# EAGLE schematic TK-BB-MD-06 (EAGLE 9.5.2)
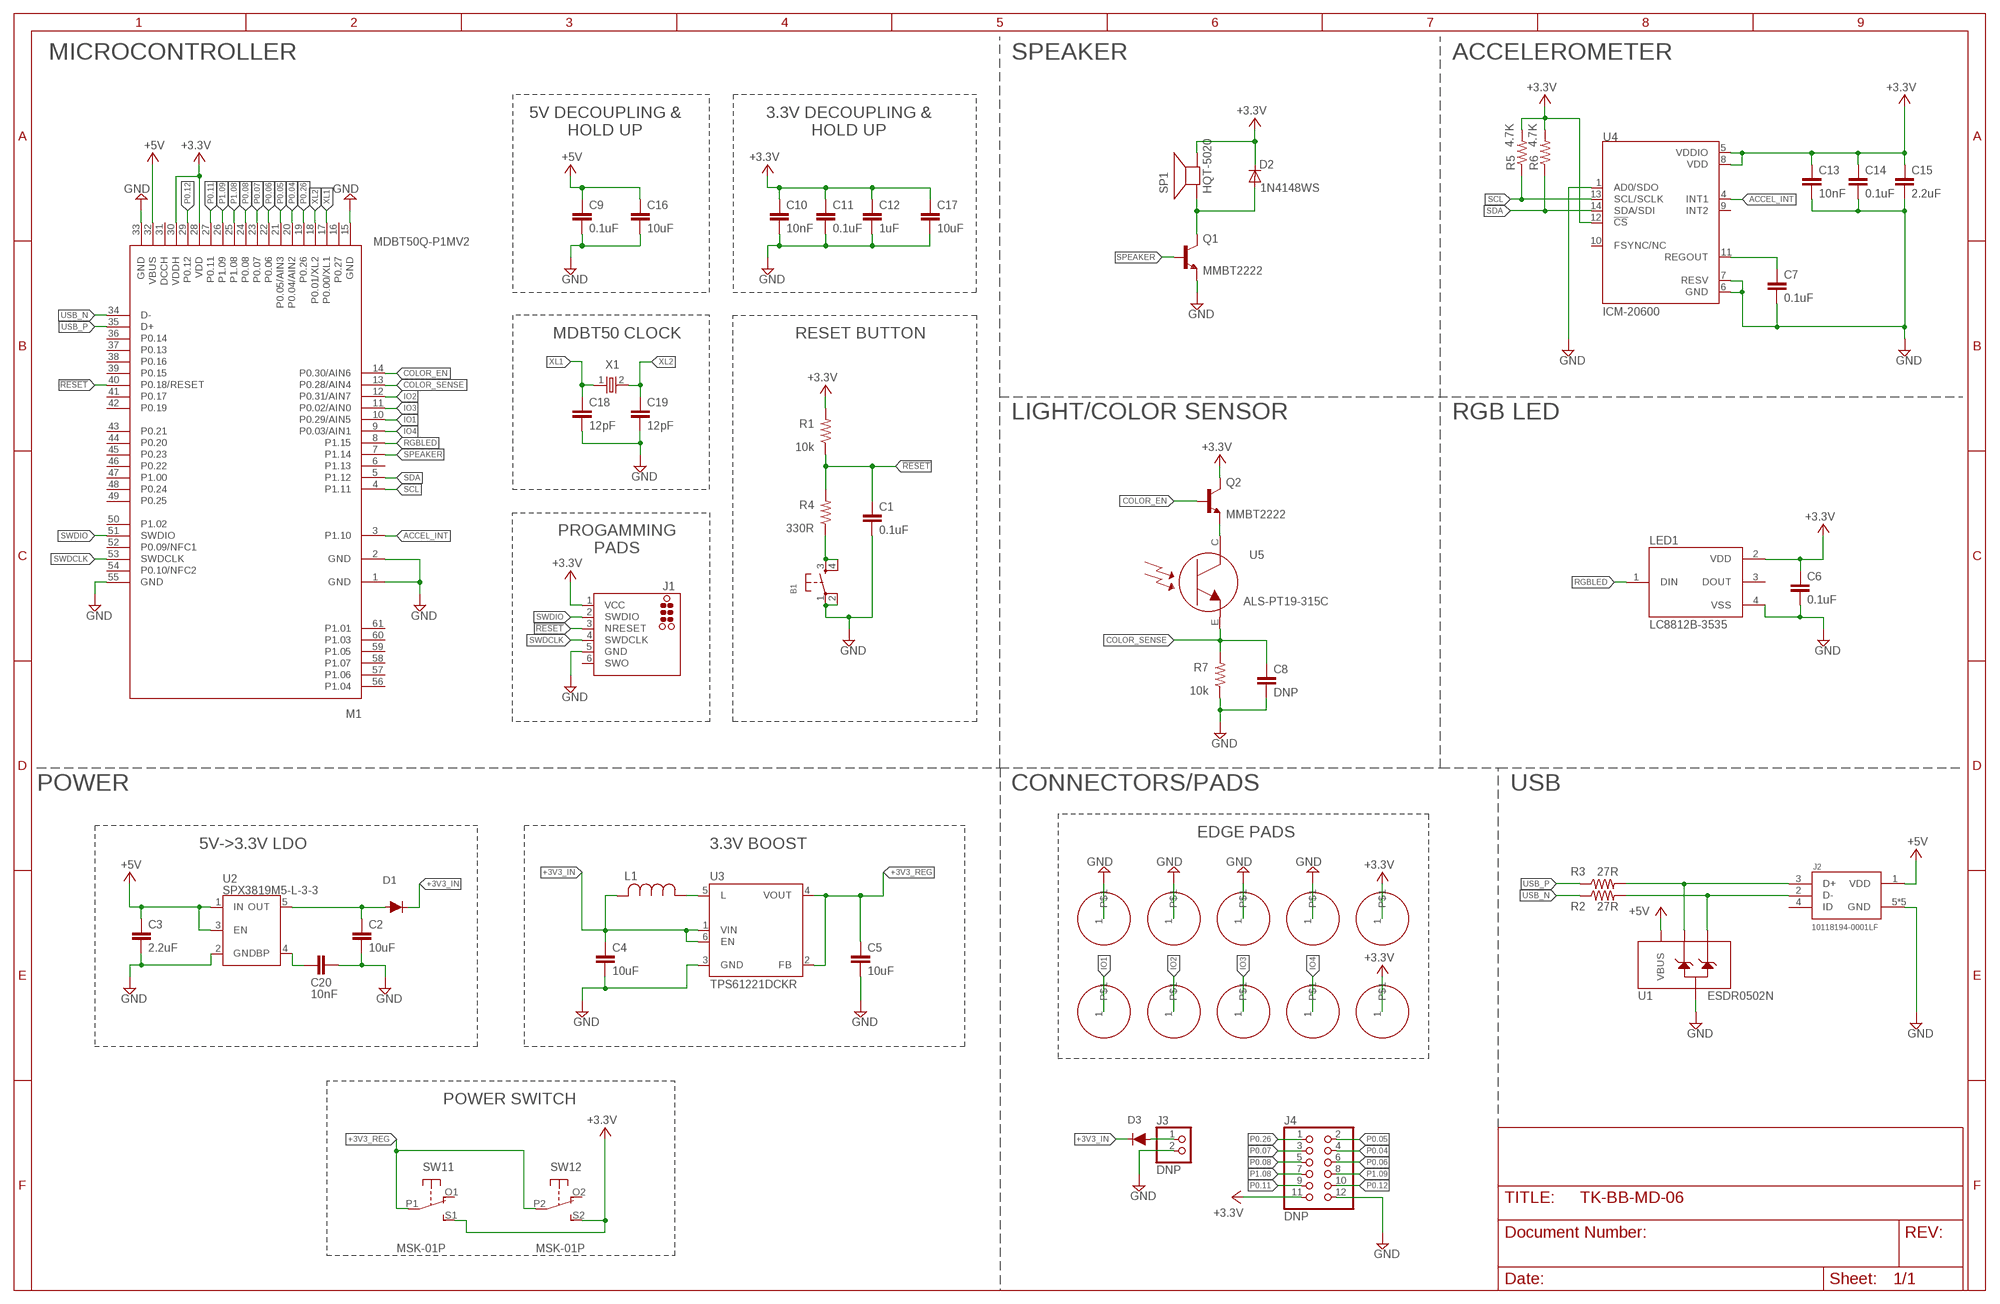
[diagram p0: schematic, sheet 1]

## Parts
B1  KFC-A04-02(H3.8)  BUTTON_SMT_3.8MMH_KFC-A04-02  [KFC-AO4-02]
C1  0.1uF  C_0.1UF_10V_0402  [0402]
C2  10uF  C_10UF_10V_0402  [0402]
C3  2.2uF  C_2.2UF_10V_0402  [0402]
C4  10uF  C_10UF_10V_0402  [0402]
C5  10uF  C_10UF_10V_0402  [0402]
C6  0.1uF  C_0.1UF_10V_0402  [0402]
C7  0.1uF  C_0.1UF_10V_0402  [0402]
C8  DNP  C_DNP_0402  [0402]
C9  0.1uF  C_0.1UF_10V_0402  [0402]
C10  10nF  C_10NF_10V_0402  [0402]
C11  0.1uF  C_0.1UF_10V_0402  [0402]
C12  1uF  C_1UF_10V_0402  [0402]
C13  10nF  C_10NF_10V_0402  [0402]
C14  0.1uF  C_0.1UF_10V_0402  [0402]
C15  2.2uF  C_2.2UF_10V_0402  [0402]
C16  10uF  C_10UF_10V_0402  [0402]
C17  10uF  C_10UF_10V_0402  [0402]
C18  12pF  C_12PF_50V_0402  [0402]
C19  12pF  C_12PF_50V_0402  [0402]
C20  10nF  C_10NF_10V_0402  [0402]
D1  NSR0320MW2T1G  DIODE_SCHOTTKY_NSR0320MW2T1G  [SOD323]
D2  1N4148WS  DIODE_1N148WSSOD-323  [SOD-323]
D3  NSR0320MW2T1G  DIODE_SCHOTTKY_NSR0320MW2T1G  [SOD323]
J1  DNP  TC2030-MCP-NL  [TC2030-MCP-NL]
J2  10118194-0001LF  [10118194-0001LF]
J3  DNP  PINHD-1X2  [1X02]
J4  DNP  PINHD-2X6  [2X06]
L1  4.7uH  SRN30104R7M_SRN3010-4R7M  [SRN30104R7M_IND_BOURNS_SRN3010]
LED1  LC8812B-3535  SK6812MINI_LC8812B-3535  [LC8812B-3535]
M1  MDBT50Q-P1MV2  [MDBT50]
P1  BB_CHICKLET_PADS_ROUND  [BB_CHICKLET_PAD]
P2  BB_CHICKLET_PADS_ROUND  [BB_CHICKLET_PAD]
P3  BB_CHICKLET_PADS_ROUND  [BB_CHICKLET_PAD]
P4  BB_CHICKLET_PADS_ROUND  [BB_CHICKLET_PAD]
P5  BB_CHICKLET_PADS_ROUND  [BB_CHICKLET_PAD]
P6  BB_CHICKLET_PADS_ROUND  [BB_CHICKLET_PAD]
P7  BB_CHICKLET_PADS_ROUND  [BB_CHICKLET_PAD]
P8  BB_CHICKLET_PADS_ROUND  [BB_CHICKLET_PAD]
P9  BB_CHICKLET_PADS_ROUND  [BB_CHICKLET_PAD]
P10  BB_CHICKLET_PADS_ROUND  [BB_CHICKLET_PAD]
Q1  MMBT2222  TRANSISTOR_NPN_MMBT2222_WIDE  [SOT23-WIDE]
Q2  MMBT2222  TRANSISTOR_NPN_MMBT2222_WIDE  [SOT23-WIDE]
R1  10k  R_10K_0.0625W_0402  [0402]
R2  27R  R_27R_0.0625W_0402  [0402]
R3  27R  R_27R_0.0625W_0402  [0402]
R4  330R  R_330R_0.0625W_0402  [0402]
R5  4.7K  R_4.7K_0.0625W_0402  [0402]
R6  4.7K  R_4.7K_0.0625W_0402  [0402]
R7  10k  R_10K_0.1W_0402  [0402]
SP1  HQT-5020  SPEAKER_HQT-5020  [HQT-5020]
SW1  MSK-01P  DPDT_MSK-01P  [MSK-01P]
U1  ESDR0502N  [6-UFDFN]
U2  SPX3819M5-L-3-3  SPX3819_3.3V  [SOT23-5]
U3  TPS61221DCKR  TPS61221  [SC70-6]
U4  ICM-20600  [ICM-20600]
U5  ALS-PT19-315C  [ALS-PT19-315C]
X1  32kHz 9pF  XTAL_32KHZ_9PF  [XTAL_3215_N]

## Nets
!RESET: C1.1 J1.3(NRESET) M1.40(P0.18/RESET) R1.1 R4.2
+3.3V: C6.1 C10.1 C11.1 C12.1 C13.1 C14.1 C15.1 C17.1 D2.C J1.1(VCC) J4.11 LED1.2(VDD) M1.28(VDD) M1.30(VDDH) P9.1 P10.1 Q2.3(C) R1.2 R5.2 R6.2 SP1.- SW1.S1(1:S) SW1.S2(2:S) U4.5(VDDIO) U4.8(VDD) U4.12(!CS)
+3V3_IN: C4.1 D1.1(C) D3.1(C) L1.2 U3.1(VIN) U3.6(EN)
+3V3_IN_HDR: D3.2(A) J3.1
+3V3_REG: C5.1 SW1.P1(1:P) SW1.P2(2:P) U3.2(FB) U3.4(VOUT)
+5V: C3.1 C9.1 C16.1 J2.1(VDD) M1.32(VBUS) U1.P$6(VBUS) U2.1(IN) U2.3(EN)
ACCEL_INT: M1.3(P1.10) U4.4(INT1)
ACCEL_REGOUT: C7.1 U4.11(REGOUT)
ALS_C: Q2.2(E) U5.C
BOOST_L: L1.1 U3.5(L)
COLOR_EN: M1.14(P0.30/AIN6) Q2.1(B)
COLOR_SENSE: C8.1 M1.13(P0.28/AIN4) R7.2 U5.E
GND: B1.1(P) B1.2(P1) C1.2 C2.2 C3.2 C4.2 C5.2 C6.2 C7.2 C8.2 C9.2 C10.2 C11.2 C12.2 C13.2 C14.2 C15.2 C16.2 C17.2 C18.2 C19.2 C20.2 J1.5(GND) J2.5(GND) J2.P$6(GND) J2.P$7(GND) J2.P$8(GND) J2.P$9(GND) J3.2 J4.12 LED1.4(VSS) M1.1(GND) M1.2(GND) M1.15(GND) M1.33(GND) M1.55(GND) P1.1 P2.1 P3.1 P8.1 Q1.2(E) R7.1 U1.P$1(GND) U2.2(GND) U3.3(GND) U4.1(AD0/SDO) U4.6(GND) U4.7(RESV)
IO1: M1.10(P0.29/AIN5) P6.1
IO2: M1.12(P0.31/AIN7) P4.1
IO3: M1.11(P0.02/AIN0) P7.1
IO4: M1.9(P0.03/AIN1) P5.1
LDO_BP: C20.1 U2.4(BP)
LDO_OUT: C2.1 D1.2(A) U2.5(OUT)
N$2: B1.3(S) B1.4(S1) R4.1
P0.04: J4.4 M1.20(P0.04/AIN2)
P0.05: J4.2 M1.21(P0.05/AIN3)
P0.06: J4.6 M1.22(P0.06)
P0.07: J4.3 M1.23(P0.07)
P0.08: J4.5 M1.24(P0.08)
P0.11: J4.9 M1.27(P0.11)
P0.12: J4.10 M1.29(P0.12)
P0.26: J4.1 M1.19(P0.26)
P1.08: J4.7 M1.25(P1.08)
P1.09: J4.8 M1.26(P1.09)
Q1_C: D2.A Q1.3(C) SP1.+
RGBLED: LED1.1(DIN) M1.8(P1.15)
SCL: M1.4(P1.11) R5.1 U4.13(SCL/SCLK)
SDA: M1.5(P1.12) R6.1 U4.14(SDA/SDI)
SPEAKER: M1.7(P1.14) Q1.1(B)
SWDCLK: J1.4(SWDCLK) M1.53(SWDCLK)
SWDIO: J1.2(SWDIO) M1.51(SWDIO)
USB_D+: J2.3(D+) R3.2 U1.P$2(D+) U1.P$5(D+)
USB_D-: J2.2(D-) R2.2 U1.P$3(D-) U1.P$4(D-)
USB_N: M1.34(D-) R2.1
USB_P: M1.35(D+) R3.1
XL1: C18.1 M1.17(P0.00/XL1) X1.1
XL2: C19.1 M1.18(P0.01/XL2) X1.2
Unconnected: J1.6(SWO) J2.4(ID) LED1.3(DOUT) M1.6(P1.13) M1.16(P0.27) M1.31(DCCH) M1.36(P0.14) M1.37(P0.13) M1.38(P0.16) M1.39(P0.15) M1.41(P0.17) M1.42(P0.19) M1.43(P0.21) M1.44(P0.20) M1.45(P0.23) M1.46(P0.22) M1.47(P1.00) M1.48(P0.24) M1.49(P0.25) M1.50(P1.02) M1.52(P0.09/NFC1) M1.54(P0.10/NFC2) M1.56(P1.04) M1.57(P1.06) M1.58(P1.07) M1.59(P1.05) M1.60(P1.03) M1.61(P1.01) SW1.O1(1:O) SW1.O2(2:O) U4.9(INT2) U4.10(FSYNC/NC)

## Notes on the sheet
- MICROCONTROLLER | SPEAKER | ACCELEROMETER
- 5V DECOUPLING &
  HOLD UP
- 3.3V DECOUPLING &
  HOLD UP
- MDBT50 CLOCK | RESET BUTTON
- LIGHT/COLOR SENSOR | RGB LED
- PROGAMMING
  PADS
- POWER | CONNECTORS/PADS | USB
- EDGE PADS
- 5V->3.3V LDO | 3.3V BOOST
- POWER SWITCH

## Library data of the parts
B1 = teknikio-button:BUTTON_SMT; DESCRIPTION: SWITCH TACT 4.5 X 4.5, 3.8 MM H; MANUFACTURER: Yeuqing City Ouke Electronics; MANUFACTURER_PART_NUMBER: KFC-A04-02(H3.8); SUPPLIER: Yeuqing City Ouke Electronics; SUPPLIER_PART_NUMBER: KFC-A04-02(H3.8)
C1 C6 C7 C9 C11 C14 = teknikio-passives:C: Standard SMD chip capacitors; DESCRIPTION: CAP CER 0.1UF 10V X7R 0402; MANUFACTURER: Yageo; MANUFACTURER_PART_NUMBER: CC0402KRX7R6BB104; SUPPLIER: Digi-Key; SUPPLIER_PART_NUMBER: 311-1345-1-ND
C2 C4 C5 C16 C17 = teknikio-passives:C: Standard SMD chip capacitors; DESCRIPTION: CAP CER 10UF 10V X5R 0402; MANUFACTURER: Samsung; MANUFACTURER_PART_NUMBER: CL05A106MP8NUB8; SUPPLIER: Digi-Key; SUPPLIER_PART_NUMBER: 1276-6830-1-ND
C3 C15 = teknikio-passives:C: Standard SMD chip capacitors; DESCRIPTION: CAP CER 2.2UF 10V X5R 0402; MANUFACTURER: Taiyo Yuden; MANUFACTURER_PART_NUMBER: LMK105BJ225MV-F; SUPPLIER: Digi-Key; SUPPLIER_PART_NUMBER: 587-3153-1-ND
C8 = teknikio-passives:C: Standard SMD chip capacitors; DESCRIPTION: 0402 CAP; MANUFACTURER: N/A; MANUFACTURER_PART_NUMBER: N/A; SUPPLIER: N/A; SUPPLIER_PART_NUMBER: N/A
C10 C13 C20 = teknikio-passives:C: Standard SMD chip capacitors; DESCRIPTION: CAP CER 10000PF 10V X7R 0402; MANUFACTURER: Yageo; MANUFACTURER_PART_NUMBER: C0402C103K8RACTU; SUPPLIER: Digi-Key; SUPPLIER_PART_NUMBER: 399-7759-1-ND
C12 = teknikio-passives:C: Standard SMD chip capacitors; DESCRIPTION: CAP CER 1UF 10V X5R 0402; MANUFACTURER: Yageo; MANUFACTURER_PART_NUMBER: CC0402KRX5R6BB105; SUPPLIER: Digi-Key; SUPPLIER_PART_NUMBER: 311-1439-1-ND
C18 C19 = teknikio-passives:C: Standard SMD chip capacitors; DESCRIPTION: CAP CER 12PF 50V C0G 0402; MANUFACTURER: TDK Corporation; MANUFACTURER_PART_NUMBER: CGA2B2C0G1H120J050BA; SUPPLIER: Digi-Key; SUPPLIER_PART_NUMBER: 445-5585-1-ND
D1 D3 = teknikio-passives:DIODE_SCHOTTKY; DESCRIPTION: DIODE SCHOTTKY 20V 1A SOD323; MANUFACTURER: ON Semiconductor; MANUFACTURER_PART_NUMBER: NSR0320MW2T1G; SUPPLIER: Digi-Key; SUPPLIER_PART_NUMBER: NSR0320MW2T1GOSCT-ND
D2 = teknikio-passives:DIODE: Diode SMA Model Volts Amps Type Vf Ir Digikey # Notes SSA34-E3 40V 3A Schottky 480mV @ 3A 200uA @ 40V SSA34-E3/61TGITR-ND CDBA120-G 20V 1A Schottky 500mV @ 1A 500uA @ 20V 641-1014-6-ND REEL MBRA210 10V 2A Schottky 350mV @ 2A 700uA @ 10V MBRA210LT3 SOD-123 Model Volts Amps Type Vf Ir Order # Notes BAT54T1G 30V 200mA Schottky 800mV @ 200mA 2uA @ 25V BAT54T1GOSTR-ND B0530W 30V 500mA Schottky 430mV @ 500mA 130uA @ 30V B0530W-FDICT-ND REEL MBR120 20V 1A Schottky 340mV @ 1A MBR120VLSFT1GOSCT-ND SOD-323 Model Volts Amps Type Vf Ir Order # Notes PMEG2005EJ 20V 500mA Schottky 355mV @ 500mA 568-4110-1-ND ZLLS410 10V 570mA Schottky 380mV @ 570mA ZLLS410CT-ND 1N4148WS 75V 150mA Silicon/Simple 1V 1N4148WSFSCT-ND REEL SOD-523 Model Volts Amps Type Vf Ir Order # Notes BAT54XV2 30V 200mA Schottky 0.8V @ 100mA BAT54XV2CT-ND TB751S 30V 30mA Schottky RB751S-40TE61CT-ND SOT23-R/W (R = Solder Paste/Reflow Ovens, W = Hand-Soldering) Model Volts Amps Type Vf Ir Order # Notes BAT54FILM 40V 300mA Schottky 497-7162-1-ND POWERDI-5 Model Volts Amps Type Vf Ir Order # Notes PDS560 60V 5A Schottky 670mV @ 5A 150uA @ 60V PDS560DICT-ND; DESCRIPTION: DIODE GEN PURP 75V 150MA SOD323F; MANUFACTURER: ON Semiconductor; MANUFACTURER_PART_NUMBER: 1N4148WS; SUPPLIER: Digi-Key; SUPPLIER_PART_NUMBER: 1N4148WSFSCT-ND
J1 = teknikio-conn:TC2030: TAG-CONNECT ICSP Connector Manufacturer: Tag-Connect <http://www.tag-connect.com> Cable for easy In-Circuit Serial Programming. Designed for Microchip ICD2, suitable for many others. Two variants - one "with legs" (for hands-free fit on PCB) and another "without legs" for quick programming. PAD Description 1 MCLR/Vpp 2 Vdd 3 GND 4 PGD (ISPDAT) 5 PGC (ISPCLK) 6 nc (used for LVP) ©2009 ROFA.cz - modified and updated by Robert Darlington ‹rdarlington@gmail.com›; DESCRIPTION: Tag-Connect ICSP Header - No Legs; MANUFACTURER: N/A; MANUFACTURER_PART_NUMBER: N/A; SUPPLIER: N/A; SUPPLIER_PART_NUMBER: N/A
J2 = teknikio-conn:10118194-0001LF: Conn Micro USB Type B RCP 5 POS 0.65mm Solder RA SMD 5 Terminal 1 Port T/R; DESCRIPTION: Conn Micro USB Type B RCP 5 POS 0.65mm Solder RA SMD 5 Terminal 1 Port T/R; MANUFACTURER: Amphenol; MANUFACTURER_PART_NUMBER: 10118194-0001LF; SUPPLIER: Digi-Key; SUPPLIER_PART_NUMBER: 609-4618-1-ND
J3 = teknikio-conn:PINHD-1X2: PIN HEADER; DESCRIPTION: CONN HEADER VERT 2POS 2.54MM; MANUFACTURER: Amphenol; MANUFACTURER_PART_NUMBER: 68000-402HLF; SUPPLIER: Digi-Key; SUPPLIER_PART_NUMBER: 609-3503-ND; VALUE: 68000-402HLF
J4 = teknikio-conn:PINHD-2X6: PIN HEADER; DESCRIPTION: CONN HEADER VERT 12POS 2ROW 2.54MM; MANUFACTURER: Amphenol; MANUFACTURER_PART_NUMBER: 67997-412HLF; SUPPLIER: Digi-Key; SUPPLIER_PART_NUMBER: 609-3244-ND; VALUE: 67997-412HLF
L1 = teknikio-passives:SRN30104R7M_SRN3010-4R7M; DESCRIPTION: FIXED IND 4.7UH 1.7A 210 MOHM; MANUFACTURER: Bourns Electronics; MANUFACTURER_PART_NUMBER: SRN30104R7M; SUPPLIER: Digi-Key; SUPPLIER_PART_NUMBER: SRN3010-4R7MCT-ND
LED1 = teknikio-led:SK6812MINI: NeoPixel Mini 3535 RGB LEDs w/ Integrated Driver Chip - White; MPN: LC8812B-3535
M1 = teknikio-ic:MDBT50: Raytac Corporation MDBT50 Bluetooth Low Energy Module based on Noridc nRF52840 Source: Raytac datasheet; DESCRIPTION: nRF52840 BLE Module, PCB Antenna; MANUFACTURER: Raytac; MANUFACTURER_PART_NUMBER: MDBT50Q-P1MV2; SUPPLIER: Raytac; SUPPLIER_PART_NUMBER: MDBT50Q-P1MV2
P1-P10 = teknikio-pads:BB_CHICKLET_PADS; DESCRIPTION: Teknikio Thru-hole Pad; MANUFACTURER: N/A; MANUFACTURER_PART_NUMBER: N/A
Q1 Q2 = teknikio-ic:TRANSISTOR_NPN: NPN Transistor; DESCRIPTION: TRANS NPN 30V 0.6A SOT23; MANUFACTURER: ON Semiconductor; MANUFACTURER_PART_NUMBER: MMBT2222LT1G; SUPPLIER: Digi-Key; SUPPLIER_PART_NUMBER: MMBT2222LT1GOSCT-ND
R1 = teknikio-passives:R: Standard SMD chip resistors; DESCRIPTION: RES SMD 10K OHM 5% 1/16W 0402; MANUFACTURER: Yageo; MANUFACTURER_PART_NUMBER: RC0402JR-0710KL; SUPPLIER: Digi-Key; SUPPLIER_PART_NUMBER: 311-10KJRCT-ND
R2 R3 = teknikio-passives:R: Standard SMD chip resistors; DESCRIPTION: RES SMD 27 OHM 1% 1/16W 0402; MANUFACTURER: Yageo; MANUFACTURER_PART_NUMBER: AC0402FR-0727RL; SUPPLIER: Digi-Key; SUPPLIER_PART_NUMBER: YAG5278CT-ND
R4 = teknikio-passives:R: Standard SMD chip resistors; DESCRIPTION: RES SMD 330 OHM 5% 1/16W 0402; MANUFACTURER: Yageo; MANUFACTURER_PART_NUMBER: RC0402JR-07330RL; SUPPLIER: Digi-Key; SUPPLIER_PART_NUMBER: 311-330JRCT-ND
R5 R6 = teknikio-passives:R: Standard SMD chip resistors; DESCRIPTION: RES SMD 4.7K OHM 5% 1/16W 0402; MANUFACTURER: Yageo; MANUFACTURER_PART_NUMBER: RC0402JR-074K7L; SUPPLIER: Digi-Key; SUPPLIER_PART_NUMBER: 311-4.7KJRCT-ND
R7 = teknikio-passives:R: Standard SMD chip resistors; DESCRIPTION: RES SMD 10K OHM 5% 1/10W 0402; MANUFACTURER: Panasonic; MANUFACTURER_PART_NUMBER: ERJ-2GEJ103X; SUPPLIER: Digi-Key; SUPPLIER_PART_NUMBER: P10KJCT-ND
SP1 = teknikio-speaker:SPEAKER: SPEAKER; DESCRIPTION: Speaker Piezo Buzzer 5mm; MANUFACTURER_PART_NUMBER: HQT-5020; SUPPLIER_PART_NUMBER: HQT-5020
SW1 = teknikio-switch:DPDT; DESCRIPTION: SWITCH SLIDE DPDT 300MA 6V; MANUFACTURER: Shenzen Gangyuan Microkey Technology; MANUFACTURER_PART_NUMBER: MSK-01P; SUPPLIER: Shenzen Gangyuan Microkey Technology; SUPPLIER_PART_NUMBER: MSK-01P
U1 = teknikio-ic:ESDR0502N; DESCRIPTION: TVS DIODE 5.5V 6UDFN; MANUFACTURER: ON Semiconductor; MANUFACTURER_PART_NUMBER: ESDR0502NMUTBG; SUPPLIER: Digi-Key; SUPPLIER_PART_NUMBER: ESDR0502NMUTBGOSCT-ND
U2 = teknikio-pwr:SPX3819; DESCRIPTION: IC REG LINEAR 3.3V 500MA SOT23-5; MANUFACTURER: MaxLinear; MANUFACTURER_PART_NUMBER: SPX3819M5-L-3-3; SUPPLIER: Digi-Key; SUPPLIER_PART_NUMBER: 1016-1873-1-ND
U3 = teknikio-pwr:TPS61221; DESCRIPTION: IC REG BST 3.3V 0.2A SYNC SC70-6; MANUFACTURER: Texas Instruments; MANUFACTURER_PART_NUMBER: TPS61221DCKR; SUPPLIER: Digi-Key; SUPPLIER_PART_NUMBER: 296-41854-1-ND
U4 = teknikio-ic:ICM-20600: Low-Power, High-Performance Integrated 6-Axis MEMS MotionTracking Device in 2.5mm x 3mm Package; DESCRIPTION: Low-Power, High-Performance Integrated 6-Axis MEMS MotionTracking Device in 2.5mm x 3mm Package; MANUFACTURER: TDK-InvenSense; MANUFACTURER_PART_NUMBER: ICM-20600; SUPPLIER: Digi-Key; SUPPLIER_PART_NUMBER: 1428-1147-1-ND
U5 = teknikio-ic:ALS-PT19-315C: ALS-PT19-315C - Analog Light Sensor VCC: 2.5-5.5V; DESCRIPTION: SENSOR PHOTO 630NM 2SMD; MANUFACTURER: Everlight Electronics Co Ltd; MANUFACTURER_PART_NUMBER: ALS-PT19-315C/L177/TR8; SUPPLIER: Digi-Key; SUPPLIER_PART_NUMBER: 1080-1244-1-ND
X1 = teknikio-ic:XTAL_32KHZ; DESCRIPTION: CRYSTAL 32.7680KHZ 9PF SMD; MANUFACTURER: ECS Inc.; MANUFACTURER_PART_NUMBER: ECS-.327-9-34B-TR; SUPPLIER: Digi-Key; SUPPLIER_PART_NUMBER: SER4084CT-ND